# Altium schematic sheet Sheet1.SchDoc
size A
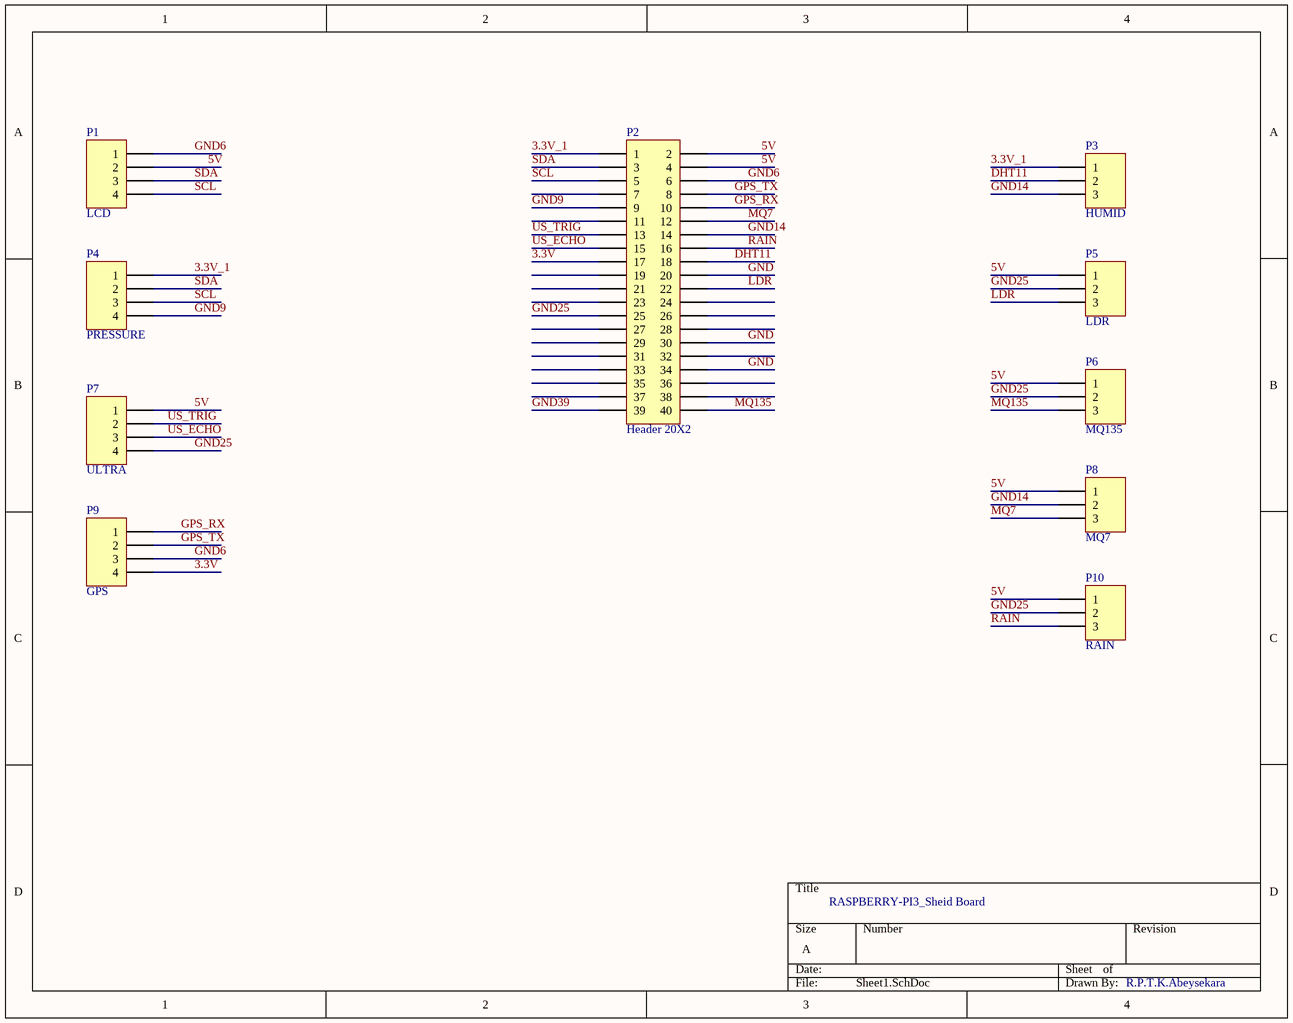
[diagram p0: Sheet1.SchDoc]

## Parts
P1  LCD  [HDR1X4]
P2  Header 20X2  [HDR2X20]
P3  HUMID  [HDR1X3]
P4  PRESSURE  [HDR1X4]
P5  LDR  [HDR1X3]
P6  MQ135  [HDR1X3]
P7  ULTRA  [HDR1X4]
P8  MQ7  [HDR1X3]
P9  GPS  [HDR1X4]
P10  RAIN  [HDR1X3]

## Nets
3.3V: P2.17 P9.4
3.3V_1: P2.1 P3.1 P4.1
5V: P1.2 P2.2 P2.4 P5.1 P6.1 P7.1 P8.1 P10.1
DHT11: P2.18 P3.2
GND: P2.20 P2.30 P2.34
GND6: P1.1 P2.6 P9.3
GND9: P2.9 P4.4
GND14: P2.14 P3.3 P8.2
GND25: P2.25 P5.2 P6.2 P7.4 P10.2
GND39: P2.39
GPS_RX: P2.10 P9.1
GPS_TX: P2.8 P9.2
LDR: P2.22 P5.3
MQ7: P2.12 P8.3
MQ135: P2.40 P6.3
RAIN: P2.16 P10.3
SCL: P1.4 P2.5 P4.3
SDA: P1.3 P2.3 P4.2
US_ECHO: P2.15 P7.3
US_TRIG: P2.13 P7.2

Not connected (* = marked no-connect by the designer): P2 7 11 19 21 23 24 26 27 28 29 31 32 33 35 36 37 38

## Notes on the sheet
- RASPBERRY-PI3_Sheid Board
- R.P.T.K.Abeysekara

## Library data of the parts
P1 P4 P7 P9 = Header 4: Header, 4-Pin; LatestRevisionDate: 17-Jul-2002; LatestRevisionNote: Re-released for DXP Platform.; Publisher: Altium Limited
P2 = Header 20X2: Header, 20-Pin, Dual row; LatestRevisionDate: 17-Jul-2002; LatestRevisionNote: Re-released for DXP Platform.; Publisher: Altium Limited
P3 P5 P6 P8 P10 = Header 3: Header, 3-Pin; LatestRevisionDate: 17-Jul-2002; LatestRevisionNote: Re-released for DXP Platform.; Publisher: Altium Limited